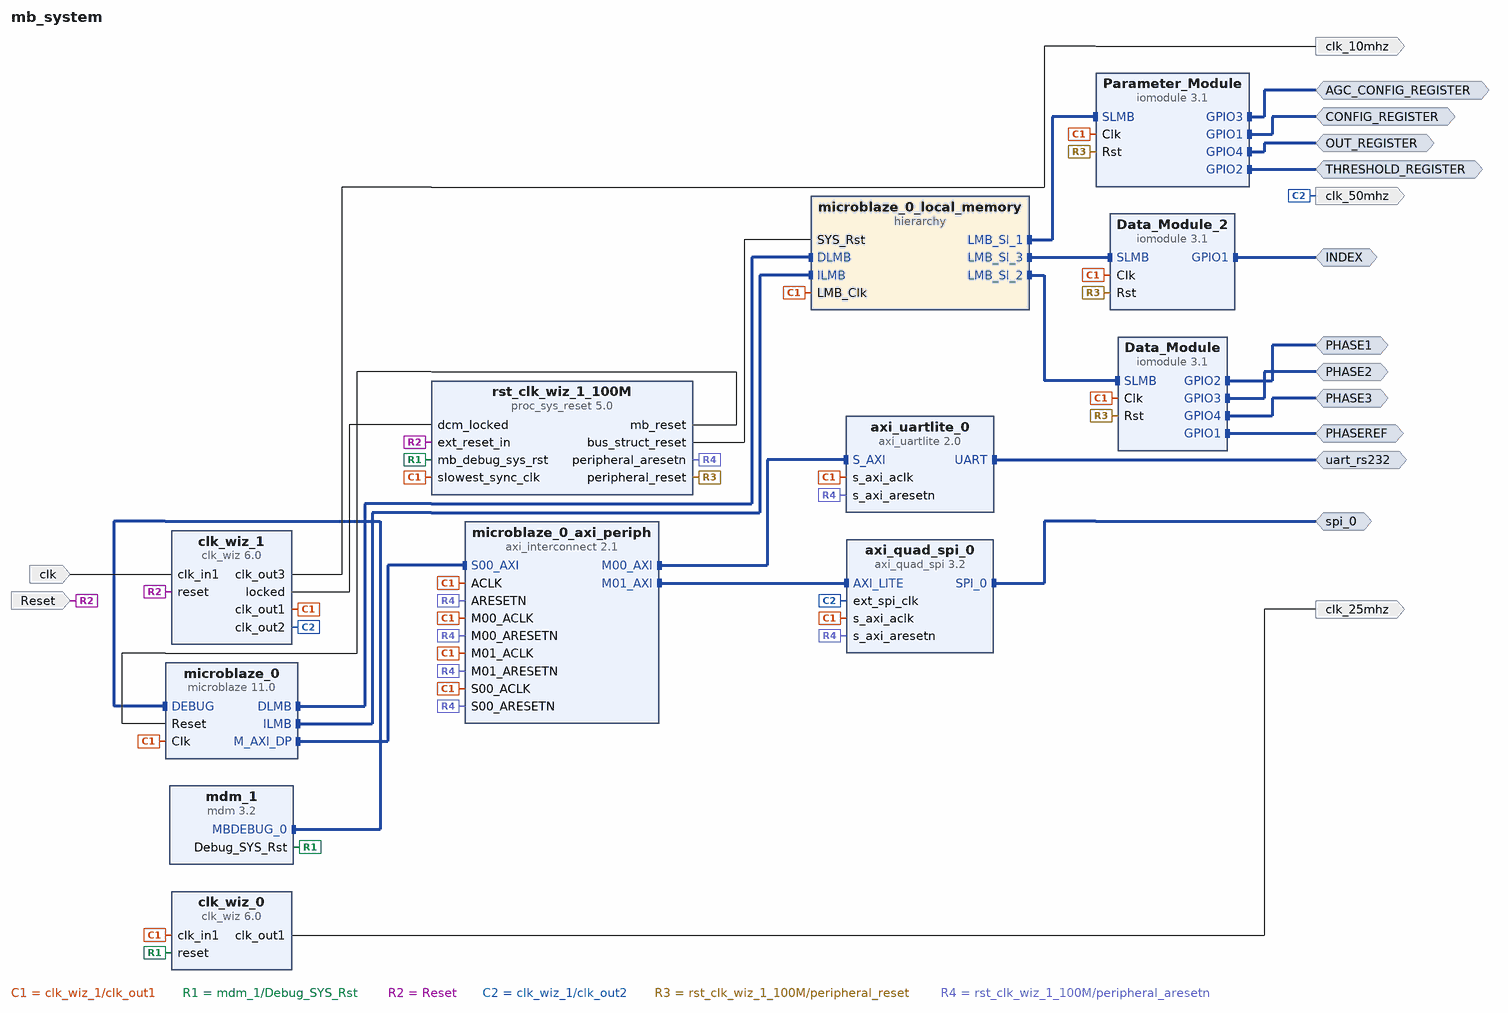
[diagram p0: block diagram of the top level]
# Vivado block design mb_system, xc7s50ftgb196-2, Vivado 2020.2
create_bd_design mb_system

create_bd_intf_port -mode Master -vlnv xilinx.com:interface:uart_rtl:1.0 uart_rs232
create_bd_intf_port -mode Master -vlnv xilinx.com:interface:spi_rtl:1.0 spi_0
create_bd_intf_port -mode Master -vlnv xilinx.com:interface:gpio_rtl:1.0 PHASE3
create_bd_intf_port -mode Master -vlnv xilinx.com:interface:gpio_rtl:1.0 PHASEREF
create_bd_intf_port -mode Master -vlnv xilinx.com:interface:gpio_rtl:1.0 PHASE1
create_bd_intf_port -mode Master -vlnv xilinx.com:interface:gpio_rtl:1.0 PHASE2
create_bd_intf_port -mode Master -vlnv xilinx.com:interface:gpio_rtl:1.0 THRESHOLD_REGISTER
create_bd_intf_port -mode Master -vlnv xilinx.com:interface:gpio_rtl:1.0 CONFIG_REGISTER
create_bd_intf_port -mode Master -vlnv xilinx.com:interface:gpio_rtl:1.0 AGC_CONFIG_REGISTER
create_bd_intf_port -mode Master -vlnv xilinx.com:interface:gpio_rtl:1.0 OUT_REGISTER
create_bd_intf_port -mode Master -vlnv xilinx.com:interface:gpio_rtl:1.0 INDEX
create_bd_port -dir I -type clk clk
set_property -dict {CONFIG.CLK_DOMAIN mb_system_clk_in CONFIG.FREQ_HZ 12000000} [get_bd_ports clk]
create_bd_port -dir I -type rst Reset
set_property -dict {CONFIG.POLARITY ACTIVE_HIGH} [get_bd_ports Reset]
create_bd_port -dir O clk_25mhz
create_bd_port -dir O clk_10mhz
create_bd_port -dir O clk_50mhz

create_bd_cell -type hier microblaze_0_local_memory
create_bd_cell -type ip -vlnv xilinx.com:ip:axi_quad_spi:3.2 axi_quad_spi_0
set_property -dict {CONFIG.C_SPI_MEMORY 4 CONFIG.C_SPI_MODE 2 CONFIG.C_S_AXI4_ID_WIDTH 0} [get_bd_cells axi_quad_spi_0]
create_bd_cell -type ip -vlnv xilinx.com:ip:axi_uartlite:2.0 axi_uartlite_0
set_property -dict {CONFIG.C_BAUDRATE 230400} [get_bd_cells axi_uartlite_0]
create_bd_cell -type ip -vlnv xilinx.com:ip:clk_wiz:6.0 clk_wiz_1
set_property -dict [list \
  CONFIG.CLKIN1_JITTER_PS 833.33 \
  CONFIG.CLKOUT1_DRIVES BUFG \
  CONFIG.CLKOUT1_JITTER 479.872 \
  CONFIG.CLKOUT1_PHASE_ERROR 668.310 \
  CONFIG.CLKOUT1_REQUESTED_DUTY_CYCLE 50.0 \
  CONFIG.CLKOUT2_DRIVES BUFG \
  CONFIG.CLKOUT2_JITTER 522.315 \
  CONFIG.CLKOUT2_PHASE_ERROR 668.310 \
  CONFIG.CLKOUT2_REQUESTED_DUTY_CYCLE 50.0 \
  CONFIG.CLKOUT2_REQUESTED_OUT_FREQ 50 \
  CONFIG.CLKOUT2_USED true \
  CONFIG.CLKOUT3_DRIVES BUFG \
  CONFIG.CLKOUT3_JITTER 705.336 \
  CONFIG.CLKOUT3_PHASE_ERROR 668.310 \
  CONFIG.CLKOUT3_REQUESTED_DUTY_CYCLE 50.0 \
  CONFIG.CLKOUT3_REQUESTED_OUT_FREQ 10 \
  CONFIG.CLKOUT3_USED true \
  CONFIG.CLKOUT4_DRIVES BUFG \
  CONFIG.CLKOUT4_JITTER 994.854 \
  CONFIG.CLKOUT4_PHASE_ERROR 613.025 \
  CONFIG.CLKOUT4_REQUESTED_DUTY_CYCLE 50.0 \
  CONFIG.CLKOUT4_REQUESTED_OUT_FREQ 5.12 \
  CONFIG.CLKOUT4_USED false \
  CONFIG.CLKOUT5_DRIVES BUFG \
  CONFIG.CLKOUT6_DRIVES BUFG \
  CONFIG.CLKOUT7_DRIVES BUFG \
  CONFIG.FEEDBACK_SOURCE FDBK_AUTO \
  CONFIG.JITTER_SEL No_Jitter \
  CONFIG.MMCM_BANDWIDTH OPTIMIZED \
  CONFIG.MMCM_CLKFBOUT_MULT_F 62.500 \
  CONFIG.MMCM_CLKIN1_PERIOD 83.333 \
  CONFIG.MMCM_CLKIN2_PERIOD 10.0 \
  CONFIG.MMCM_CLKOUT0_DIVIDE_F 7.500 \
  CONFIG.MMCM_CLKOUT0_DUTY_CYCLE 0.500 \
  CONFIG.MMCM_CLKOUT1_DIVIDE 15 \
  CONFIG.MMCM_CLKOUT1_DUTY_CYCLE 0.500 \
  CONFIG.MMCM_CLKOUT2_DIVIDE 75 \
  CONFIG.MMCM_CLKOUT3_DIVIDE 1 \
  CONFIG.MMCM_COMPENSATION ZHOLD \
  CONFIG.NUM_OUT_CLKS 3 \
  CONFIG.PRIMITIVE MMCM \
  CONFIG.PRIM_IN_FREQ 12 \
  CONFIG.PRIM_SOURCE Single_ended_clock_capable_pin \
  CONFIG.SECONDARY_SOURCE Single_ended_clock_capable_pin \
  CONFIG.USE_MIN_POWER false \
  CONFIG.USE_PHASE_ALIGNMENT true \
  CONFIG.USE_SPREAD_SPECTRUM false \
] [get_bd_cells clk_wiz_1]
create_bd_cell -type ip -vlnv xilinx.com:ip:iomodule:3.1 Parameter_Module
set_property -dict [list \
  CONFIG.C_GPO1_SIZE 32 \
  CONFIG.C_GPO2_SIZE 32 \
  CONFIG.C_GPO3_SIZE 32 \
  CONFIG.C_USE_GPI1 0 \
  CONFIG.C_USE_GPI4 1 \
  CONFIG.C_USE_GPO1 1 \
  CONFIG.C_USE_GPO2 1 \
  CONFIG.C_USE_GPO3 1 \
  CONFIG.C_USE_GPO4 0 \
] [get_bd_cells Parameter_Module]
create_bd_cell -type ip -vlnv xilinx.com:ip:iomodule:3.1 Data_Module
set_property -dict [list \
  CONFIG.C_GPI1_SIZE 32 \
  CONFIG.C_GPI2_SIZE 32 \
  CONFIG.C_GPI3_SIZE 32 \
  CONFIG.C_GPI4_SIZE 32 \
  CONFIG.C_TMR 0 \
  CONFIG.C_USE_GPI1 1 \
  CONFIG.C_USE_GPI2 1 \
  CONFIG.C_USE_GPI3 1 \
  CONFIG.C_USE_GPI4 1 \
  CONFIG.C_USE_IO_BUS 0 \
] [get_bd_cells Data_Module]
create_bd_cell -type ip -vlnv xilinx.com:ip:mdm:3.2 mdm_1
create_bd_cell -type ip -vlnv xilinx.com:ip:microblaze:11.0 microblaze_0
set_property -dict [list \
  CONFIG.C_ADDR_TAG_BITS 0 \
  CONFIG.C_DCACHE_ADDR_TAG 0 \
  CONFIG.C_DEBUG_ENABLED 1 \
  CONFIG.C_DIV_ZERO_EXCEPTION 1 \
  CONFIG.C_D_AXI 1 \
  CONFIG.C_D_LMB 1 \
  CONFIG.C_ILL_OPCODE_EXCEPTION 1 \
  CONFIG.C_I_LMB 1 \
  CONFIG.C_M_AXI_D_BUS_EXCEPTION 1 \
  CONFIG.C_NUMBER_OF_PC_BRK 2 \
  CONFIG.C_OPCODE_0x0_ILLEGAL 1 \
  CONFIG.C_UNALIGNED_EXCEPTIONS 1 \
  CONFIG.C_USE_BARREL 1 \
  CONFIG.C_USE_DCACHE 0 \
  CONFIG.C_USE_DIV 1 \
  CONFIG.C_USE_HW_MUL 1 \
  CONFIG.C_USE_ICACHE 0 \
  CONFIG.C_USE_MSR_INSTR 1 \
  CONFIG.C_USE_PCMP_INSTR 1 \
  CONFIG.C_USE_STACK_PROTECTION 1 \
  CONFIG.G_TEMPLATE_LIST 9 \
  CONFIG.G_USE_EXCEPTIONS 1 \
] [get_bd_cells microblaze_0]
create_bd_cell -type ip -vlnv xilinx.com:ip:axi_interconnect:2.1 microblaze_0_axi_periph
set_property -dict {CONFIG.NUM_MI 2} [get_bd_cells microblaze_0_axi_periph]
create_bd_cell -type ip -vlnv xilinx.com:ip:proc_sys_reset:5.0 rst_clk_wiz_1_100M
create_bd_cell -type ip -vlnv xilinx.com:ip:clk_wiz:6.0 clk_wiz_0
set_property -dict [list \
  CONFIG.CLKOUT1_DRIVES BUFG \
  CONFIG.CLKOUT1_JITTER 231.760 \
  CONFIG.CLKOUT1_PHASE_ERROR 320.726 \
  CONFIG.CLKOUT1_REQUESTED_OUT_FREQ 25.6 \
  CONFIG.CLKOUT2_DRIVES BUFG \
  CONFIG.CLKOUT3_DRIVES BUFG \
  CONFIG.CLKOUT4_DRIVES BUFG \
  CONFIG.CLKOUT5_DRIVES BUFG \
  CONFIG.CLKOUT6_DRIVES BUFG \
  CONFIG.CLKOUT7_DRIVES BUFG \
  CONFIG.MMCM_BANDWIDTH OPTIMIZED \
  CONFIG.MMCM_CLKFBOUT_MULT_F 64 \
  CONFIG.MMCM_CLKOUT0_DIVIDE_F 50 \
  CONFIG.MMCM_COMPENSATION BUF_IN \
  CONFIG.MMCM_DIVCLK_DIVIDE 5 \
  CONFIG.OVERRIDE_MMCM true \
  CONFIG.PRIMITIVE PLL \
] [get_bd_cells clk_wiz_0]
create_bd_cell -type ip -vlnv xilinx.com:ip:iomodule:3.1 Data_Module_2
set_property -dict {CONFIG.C_GPI1_SIZE 17 CONFIG.C_USE_GPI1 1 CONFIG.C_USE_GPI4 0} [get_bd_cells Data_Module_2]

# ---- hierarchy /microblaze_0_local_memory ----
current_bd_instance /microblaze_0_local_memory
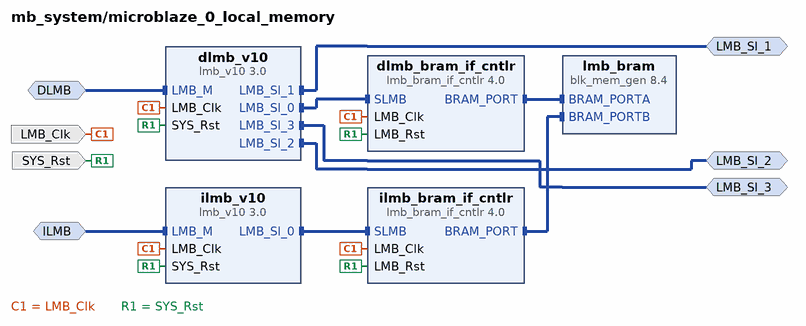
[diagram p1: block diagram inside /microblaze_0_local_memory]
create_bd_intf_pin -mode MirroredMaster -vlnv xilinx.com:interface:lmb_rtl:1.0 DLMB
create_bd_intf_pin -mode MirroredMaster -vlnv xilinx.com:interface:lmb_rtl:1.0 ILMB
create_bd_intf_pin -mode MirroredSlave -vlnv xilinx.com:interface:lmb_rtl:1.0 LMB_Sl_1
create_bd_intf_pin -mode MirroredSlave -vlnv xilinx.com:interface:lmb_rtl:1.0 LMB_Sl_2
create_bd_intf_pin -mode MirroredSlave -vlnv xilinx.com:interface:lmb_rtl:1.0 LMB_Sl_3
create_bd_pin -dir I -type clk LMB_Clk
create_bd_pin -dir I -type rst SYS_Rst

create_bd_cell -type ip -vlnv xilinx.com:ip:lmb_bram_if_cntlr:4.0 dlmb_bram_if_cntlr
set_property -dict {CONFIG.C_ECC 0} [get_bd_cells dlmb_bram_if_cntlr]
create_bd_cell -type ip -vlnv xilinx.com:ip:lmb_v10:3.0 dlmb_v10
set_property -dict {CONFIG.C_LMB_NUM_SLAVES 4} [get_bd_cells dlmb_v10]
create_bd_cell -type ip -vlnv xilinx.com:ip:lmb_bram_if_cntlr:4.0 ilmb_bram_if_cntlr
set_property -dict {CONFIG.C_ECC 0} [get_bd_cells ilmb_bram_if_cntlr]
create_bd_cell -type ip -vlnv xilinx.com:ip:lmb_v10:3.0 ilmb_v10
create_bd_cell -type ip -vlnv xilinx.com:ip:blk_mem_gen:8.4 lmb_bram
set_property -dict [list \
  CONFIG.Enable_B Use_ENB_Pin \
  CONFIG.Memory_Type True_Dual_Port_RAM \
  CONFIG.Port_B_Clock 100 \
  CONFIG.Port_B_Enable_Rate 100 \
  CONFIG.Port_B_Write_Rate 50 \
  CONFIG.Use_RSTB_Pin true \
  CONFIG.use_bram_block BRAM_Controller \
] [get_bd_cells lmb_bram]

# ---- connections ----

current_bd_instance /microblaze_0_local_memory
connect_bd_intf_net -intf_net microblaze_0_dlmb_bus [get_bd_intf_pins dlmb_v10/LMB_Sl_0] [get_bd_intf_pins dlmb_bram_if_cntlr/SLMB]
connect_bd_intf_net -intf_net microblaze_0_dlmb [get_bd_intf_pins DLMB] [get_bd_intf_pins dlmb_v10/LMB_M]
connect_bd_intf_net -intf_net dlmb_v10_iomodule_2 [get_bd_intf_pins LMB_Sl_3] [get_bd_intf_pins dlmb_v10/LMB_Sl_3]
connect_bd_intf_net -intf_net microblaze_0_dlmb_cntlr [get_bd_intf_pins dlmb_bram_if_cntlr/BRAM_PORT] [get_bd_intf_pins lmb_bram/BRAM_PORTA]
connect_bd_intf_net -intf_net dlmb_v10_iomodule_1 [get_bd_intf_pins LMB_Sl_2] [get_bd_intf_pins dlmb_v10/LMB_Sl_2]
connect_bd_intf_net -intf_net microblaze_0_ilmb_cntlr [get_bd_intf_pins ilmb_bram_if_cntlr/BRAM_PORT] [get_bd_intf_pins lmb_bram/BRAM_PORTB]
connect_bd_intf_net -intf_net microblaze_0_ilmb_bus [get_bd_intf_pins ilmb_v10/LMB_Sl_0] [get_bd_intf_pins ilmb_bram_if_cntlr/SLMB]
connect_bd_intf_net -intf_net dlmb_v10_iomodule_0 [get_bd_intf_pins LMB_Sl_1] [get_bd_intf_pins dlmb_v10/LMB_Sl_1]
connect_bd_intf_net -intf_net microblaze_0_ilmb [get_bd_intf_pins ILMB] [get_bd_intf_pins ilmb_v10/LMB_M]
connect_bd_net -net microblaze_0_Clk [get_bd_pins LMB_Clk] \
  [get_bd_pins dlmb_bram_if_cntlr/LMB_Clk] [get_bd_pins dlmb_v10/LMB_Clk] [get_bd_pins ilmb_bram_if_cntlr/LMB_Clk] \
  [get_bd_pins ilmb_v10/LMB_Clk]
connect_bd_net [get_bd_pins SYS_Rst] \
  [get_bd_pins dlmb_bram_if_cntlr/LMB_Rst] [get_bd_pins dlmb_v10/SYS_Rst] [get_bd_pins ilmb_bram_if_cntlr/LMB_Rst] \
  [get_bd_pins ilmb_v10/SYS_Rst]
set_property HDL_ATTRIBUTE.BMM_INFO_ADDRESS_SPACE {byte  0x00000000 32 > mb_system microblaze_0_local_memory/lmb_bram} [get_bd_cells dlmb_bram_if_cntlr]
set_property HDL_ATTRIBUTE.KEEP_HIERARCHY yes [get_bd_cells dlmb_bram_if_cntlr]

current_bd_instance /
connect_bd_intf_net [get_bd_intf_ports uart_rs232] [get_bd_intf_pins axi_uartlite_0/UART]
connect_bd_intf_net [get_bd_intf_pins microblaze_0_axi_periph/M01_AXI] [get_bd_intf_pins axi_quad_spi_0/AXI_LITE]
connect_bd_intf_net [get_bd_intf_ports spi_0] [get_bd_intf_pins axi_quad_spi_0/SPI_0]
connect_bd_intf_net [get_bd_intf_pins microblaze_0/DLMB] [get_bd_intf_pins microblaze_0_local_memory/DLMB]
connect_bd_intf_net -intf_net iomodule_1_GPIO2 [get_bd_intf_ports THRESHOLD_REGISTER] [get_bd_intf_pins Parameter_Module/GPIO2]
connect_bd_intf_net [get_bd_intf_pins microblaze_0_axi_periph/M00_AXI] [get_bd_intf_pins axi_uartlite_0/S_AXI]
connect_bd_intf_net [get_bd_intf_pins mdm_1/MBDEBUG_0] [get_bd_intf_pins microblaze_0/DEBUG]
connect_bd_intf_net -intf_net dlmb_v10_iomodule_0 [get_bd_intf_pins Data_Module_2/SLMB] [get_bd_intf_pins microblaze_0_local_memory/LMB_Sl_3]
connect_bd_intf_net [get_bd_intf_ports PHASE2] [get_bd_intf_pins Data_Module/GPIO3]
connect_bd_intf_net [get_bd_intf_ports AGC_CONFIG_REGISTER] [get_bd_intf_pins Parameter_Module/GPIO3]
connect_bd_intf_net [get_bd_intf_ports PHASE1] [get_bd_intf_pins Data_Module/GPIO2]
connect_bd_intf_net -intf_net iomodule_1_GPIO1 [get_bd_intf_ports CONFIG_REGISTER] [get_bd_intf_pins Parameter_Module/GPIO1]
connect_bd_intf_net [get_bd_intf_pins microblaze_0/ILMB] [get_bd_intf_pins microblaze_0_local_memory/ILMB]
connect_bd_intf_net [get_bd_intf_pins microblaze_0/M_AXI_DP] [get_bd_intf_pins microblaze_0_axi_periph/S00_AXI]
connect_bd_intf_net [get_bd_intf_ports PHASE3] [get_bd_intf_pins Data_Module/GPIO4]
connect_bd_intf_net [get_bd_intf_ports OUT_REGISTER] [get_bd_intf_pins Parameter_Module/GPIO4]
connect_bd_intf_net [get_bd_intf_pins microblaze_0_local_memory/LMB_Sl_1] [get_bd_intf_pins Parameter_Module/SLMB]
connect_bd_intf_net [get_bd_intf_ports PHASEREF] [get_bd_intf_pins Data_Module/GPIO1]
connect_bd_intf_net [get_bd_intf_pins microblaze_0_local_memory/LMB_Sl_2] [get_bd_intf_pins Data_Module/SLMB]
connect_bd_intf_net -intf_net iomodule_0_GPIO1 [get_bd_intf_ports INDEX] [get_bd_intf_pins Data_Module_2/GPIO1]
connect_bd_net -net microblaze_0_Clk [get_bd_pins clk_wiz_1/clk_out1] \
  [get_bd_pins microblaze_0_local_memory/LMB_Clk] [get_bd_pins axi_quad_spi_0/s_axi_aclk] \
  [get_bd_pins axi_uartlite_0/s_axi_aclk] [get_bd_pins Parameter_Module/Clk] [get_bd_pins Data_Module/Clk] \
  [get_bd_pins microblaze_0/Clk] [get_bd_pins microblaze_0_axi_periph/ACLK] [get_bd_pins microblaze_0_axi_periph/S00_ACLK] \
  [get_bd_pins microblaze_0_axi_periph/M00_ACLK] [get_bd_pins microblaze_0_axi_periph/M01_ACLK] \
  [get_bd_pins rst_clk_wiz_1_100M/slowest_sync_clk] [get_bd_pins clk_wiz_0/clk_in1] [get_bd_pins Data_Module_2/Clk]
connect_bd_net [get_bd_pins clk_wiz_1/locked] [get_bd_pins rst_clk_wiz_1_100M/dcm_locked]
connect_bd_net [get_bd_pins rst_clk_wiz_1_100M/mb_reset] [get_bd_pins microblaze_0/Reset]
connect_bd_net [get_bd_pins rst_clk_wiz_1_100M/bus_struct_reset] [get_bd_pins microblaze_0_local_memory/SYS_Rst]
connect_bd_net [get_bd_pins mdm_1/Debug_SYS_Rst] [get_bd_pins rst_clk_wiz_1_100M/mb_debug_sys_rst] [get_bd_pins clk_wiz_0/reset]
connect_bd_net [get_bd_ports clk] [get_bd_pins clk_wiz_1/clk_in1]
connect_bd_net [get_bd_ports Reset] [get_bd_pins clk_wiz_1/reset] [get_bd_pins rst_clk_wiz_1_100M/ext_reset_in]
connect_bd_net [get_bd_pins clk_wiz_1/clk_out2] [get_bd_ports clk_50mhz] [get_bd_pins axi_quad_spi_0/ext_spi_clk]
connect_bd_net [get_bd_pins clk_wiz_1/clk_out3] [get_bd_ports clk_10mhz]
connect_bd_net [get_bd_pins clk_wiz_0/clk_out1] [get_bd_ports clk_25mhz]
connect_bd_net [get_bd_pins rst_clk_wiz_1_100M/peripheral_reset] \
  [get_bd_pins Parameter_Module/Rst] [get_bd_pins Data_Module/Rst] [get_bd_pins Data_Module_2/Rst]
connect_bd_net [get_bd_pins rst_clk_wiz_1_100M/peripheral_aresetn] \
  [get_bd_pins axi_quad_spi_0/s_axi_aresetn] [get_bd_pins axi_uartlite_0/s_axi_aresetn] \
  [get_bd_pins microblaze_0_axi_periph/M01_ARESETN] [get_bd_pins microblaze_0_axi_periph/M00_ARESETN] \
  [get_bd_pins microblaze_0_axi_periph/S00_ARESETN] [get_bd_pins microblaze_0_axi_periph/ARESETN]
set_property HDL_ATTRIBUTE.BMM_INFO_PROCESSOR {microblaze-le > mb_system microblaze_0_local_memory/dlmb_bram_if_cntlr} [get_bd_cells microblaze_0]
set_property HDL_ATTRIBUTE.KEEP_HIERARCHY yes [get_bd_cells microblaze_0]

# ---- address map ----
assign_bd_address -offset 0x00000000 -range 128K -target_address_space [get_bd_addr_spaces microblaze_0/Data] [get_bd_addr_segs microblaze_0_local_memory/dlmb_bram_if_cntlr/SLMB/Mem]
assign_bd_address -offset 0x40600000 -range 64K -target_address_space [get_bd_addr_spaces microblaze_0/Data] [get_bd_addr_segs axi_uartlite_0/S_AXI/Reg]
assign_bd_address -offset 0x44A00000 -range 64K -target_address_space [get_bd_addr_spaces microblaze_0/Data] [get_bd_addr_segs axi_quad_spi_0/AXI_LITE/Reg]
assign_bd_address -offset 0x44A10000 -range 64K -target_address_space [get_bd_addr_spaces microblaze_0/Data] [get_bd_addr_segs Data_Module_2/SLMB/Reg]
assign_bd_address -offset 0x44A20000 -range 64K -target_address_space [get_bd_addr_spaces microblaze_0/Data] [get_bd_addr_segs Parameter_Module/SLMB/Reg]
assign_bd_address -offset 0x44A30000 -range 64K -target_address_space [get_bd_addr_spaces microblaze_0/Data] [get_bd_addr_segs Data_Module/SLMB/Reg]
assign_bd_address -offset 0x00000000 -range 128K -target_address_space [get_bd_addr_spaces microblaze_0/Instruction] [get_bd_addr_segs microblaze_0_local_memory/ilmb_bram_if_cntlr/SLMB/Mem]

validate_bd_design
save_bd_design
